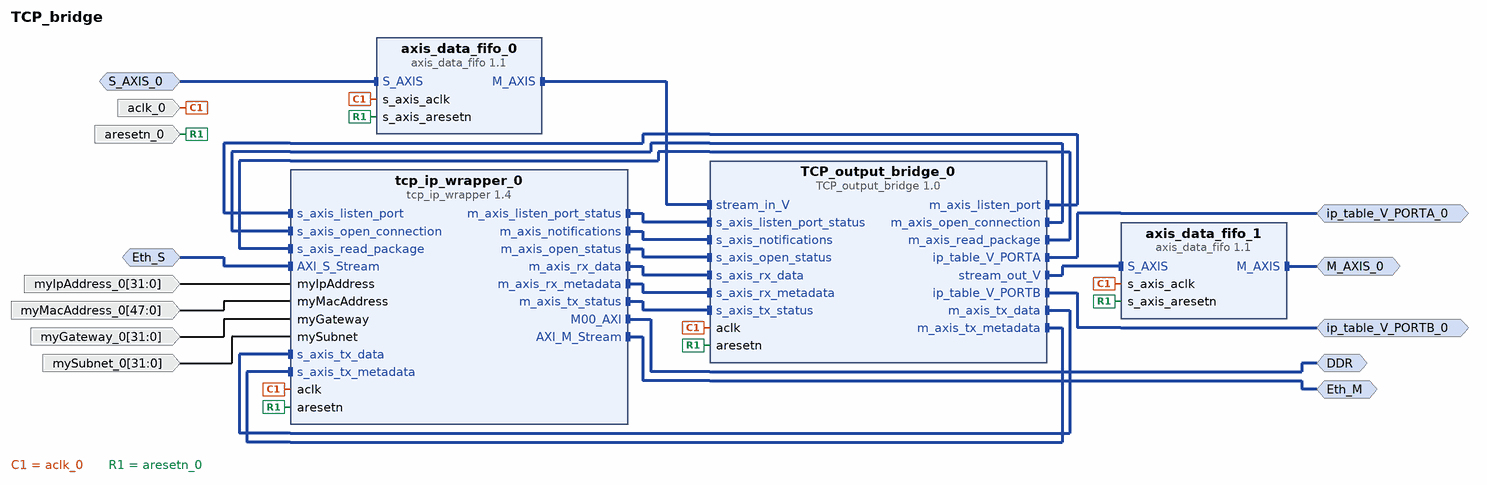
[diagram p0: block diagram of the top level]
# Vivado block design TCP_bridge, xcku115-flva1517-2-e, Vivado 2018.1
create_bd_design TCP_bridge

create_bd_intf_port -mode Slave -vlnv xilinx.com:interface:axis_rtl:1.0 Eth_S
set_property -dict [list \
  CONFIG.TDATA_NUM_BYTES 8 \
  CONFIG.TDEST_WIDTH 0 \
  CONFIG.TID_WIDTH 0 \
  CONFIG.TUSER_WIDTH 0 \
  CONFIG.HAS_TREADY 1 \
  CONFIG.HAS_TSTRB 0 \
  CONFIG.HAS_TKEEP 1 \
  CONFIG.HAS_TLAST 1 \
  CONFIG.LAYERED_METADATA undef \
] [get_bd_intf_ports Eth_S]
create_bd_intf_port -mode Slave -vlnv xilinx.com:interface:axis_rtl:1.0 S_AXIS_0
set_property -dict [list \
  CONFIG.TDATA_NUM_BYTES 8 \
  CONFIG.TDEST_WIDTH 16 \
  CONFIG.TID_WIDTH 0 \
  CONFIG.TUSER_WIDTH 0 \
  CONFIG.HAS_TREADY 1 \
  CONFIG.HAS_TSTRB 0 \
  CONFIG.HAS_TKEEP 1 \
  CONFIG.HAS_TLAST 1 \
  CONFIG.LAYERED_METADATA undef \
] [get_bd_intf_ports S_AXIS_0]
create_bd_intf_port -mode Master -vlnv xilinx.com:interface:axis_rtl:1.0 M_AXIS_0
create_bd_intf_port -mode Master -vlnv xilinx.com:interface:aximm_rtl:1.0 DDR
set_property -dict [list \
  CONFIG.DATA_WIDTH 64 \
  CONFIG.PROTOCOL AXI4 \
  CONFIG.ADDR_WIDTH 32 \
  CONFIG.HAS_REGION 0 \
  CONFIG.NUM_READ_OUTSTANDING 2 \
  CONFIG.NUM_WRITE_OUTSTANDING 2 \
] [get_bd_intf_ports DDR]
create_bd_intf_port -mode Master -vlnv xilinx.com:interface:axis_rtl:1.0 Eth_M
create_bd_intf_port -mode Master -vlnv xilinx.com:interface:bram_rtl:1.0 ip_table_V_PORTA_0
set_property -dict {CONFIG.MASTER_TYPE BRAM_CTRL} [get_bd_intf_ports ip_table_V_PORTA_0]
create_bd_intf_port -mode Master -vlnv xilinx.com:interface:bram_rtl:1.0 ip_table_V_PORTB_0
set_property -dict {CONFIG.MASTER_TYPE BRAM_CTRL} [get_bd_intf_ports ip_table_V_PORTB_0]
create_bd_port -dir I -type clk aclk_0
set_property -dict {CONFIG.ASSOCIATED_BUSIF Eth_S:S_AXIS_0:M_AXIS_0:DDR:Eth_M} [get_bd_ports aclk_0]
create_bd_port -dir I -type rst aresetn_0
create_bd_port -dir I -from 31 -to 0 myIpAddress_0
create_bd_port -dir I -from 47 -to 0 myMacAddress_0
create_bd_port -dir I -from 31 -to 0 myGateway_0
create_bd_port -dir I -from 31 -to 0 mySubnet_0

create_bd_cell -type ip -vlnv dlyma.org:dlyma:tcp_ip_wrapper:1.4 tcp_ip_wrapper_0
set_property -dict {CONFIG.UDP_ENABLE false} [get_bd_cells tcp_ip_wrapper_0]
create_bd_cell -type ip -vlnv xilinx.com:ip:axis_data_fifo:1.1 axis_data_fifo_0
create_bd_cell -type ip -vlnv xilinx.com:ip:axis_data_fifo:1.1 axis_data_fifo_1
create_bd_cell -type ip -vlnv xilinx.com:hls:TCP_output_bridge:1.0 TCP_output_bridge_0

# ---- connections ----

connect_bd_intf_net [get_bd_intf_pins tcp_ip_wrapper_0/m_axis_listen_port_status] [get_bd_intf_pins TCP_output_bridge_0/s_axis_listen_port_status]
connect_bd_intf_net [get_bd_intf_pins tcp_ip_wrapper_0/m_axis_notifications] [get_bd_intf_pins TCP_output_bridge_0/s_axis_notifications]
connect_bd_intf_net [get_bd_intf_pins tcp_ip_wrapper_0/m_axis_open_status] [get_bd_intf_pins TCP_output_bridge_0/s_axis_open_status]
connect_bd_intf_net [get_bd_intf_pins tcp_ip_wrapper_0/m_axis_rx_data] [get_bd_intf_pins TCP_output_bridge_0/s_axis_rx_data]
connect_bd_intf_net [get_bd_intf_pins tcp_ip_wrapper_0/m_axis_rx_metadata] [get_bd_intf_pins TCP_output_bridge_0/s_axis_rx_metadata]
connect_bd_intf_net [get_bd_intf_pins tcp_ip_wrapper_0/m_axis_tx_status] [get_bd_intf_pins TCP_output_bridge_0/s_axis_tx_status]
connect_bd_intf_net [get_bd_intf_pins tcp_ip_wrapper_0/s_axis_listen_port] [get_bd_intf_pins TCP_output_bridge_0/m_axis_listen_port]
connect_bd_intf_net [get_bd_intf_pins tcp_ip_wrapper_0/s_axis_open_connection] [get_bd_intf_pins TCP_output_bridge_0/m_axis_open_connection]
connect_bd_intf_net [get_bd_intf_pins tcp_ip_wrapper_0/s_axis_read_package] [get_bd_intf_pins TCP_output_bridge_0/m_axis_read_package]
connect_bd_intf_net [get_bd_intf_pins tcp_ip_wrapper_0/s_axis_tx_data] [get_bd_intf_pins TCP_output_bridge_0/m_axis_tx_data]
connect_bd_intf_net [get_bd_intf_pins tcp_ip_wrapper_0/s_axis_tx_metadata] [get_bd_intf_pins TCP_output_bridge_0/m_axis_tx_metadata]
connect_bd_intf_net [get_bd_intf_pins axis_data_fifo_0/M_AXIS] [get_bd_intf_pins TCP_output_bridge_0/stream_in_V]
connect_bd_intf_net [get_bd_intf_pins TCP_output_bridge_0/stream_out_V] [get_bd_intf_pins axis_data_fifo_1/S_AXIS]
connect_bd_intf_net -intf_net AXI_S_Stream_0_1 [get_bd_intf_ports Eth_S] [get_bd_intf_pins tcp_ip_wrapper_0/AXI_S_Stream]
connect_bd_intf_net -intf_net S_AXIS_0_1 [get_bd_intf_ports S_AXIS_0] [get_bd_intf_pins axis_data_fifo_0/S_AXIS]
connect_bd_intf_net [get_bd_intf_ports M_AXIS_0] [get_bd_intf_pins axis_data_fifo_1/M_AXIS]
connect_bd_intf_net [get_bd_intf_ports DDR] [get_bd_intf_pins tcp_ip_wrapper_0/M00_AXI]
connect_bd_intf_net [get_bd_intf_ports Eth_M] [get_bd_intf_pins tcp_ip_wrapper_0/AXI_M_Stream]
connect_bd_intf_net [get_bd_intf_ports ip_table_V_PORTA_0] [get_bd_intf_pins TCP_output_bridge_0/ip_table_V_PORTA]
connect_bd_intf_net [get_bd_intf_ports ip_table_V_PORTB_0] [get_bd_intf_pins TCP_output_bridge_0/ip_table_V_PORTB]
connect_bd_net -net aclk_0_1 [get_bd_ports aclk_0] \
  [get_bd_pins tcp_ip_wrapper_0/aclk] [get_bd_pins axis_data_fifo_1/s_axis_aclk] [get_bd_pins axis_data_fifo_0/s_axis_aclk] \
  [get_bd_pins TCP_output_bridge_0/aclk]
connect_bd_net -net aresetn_0_1 [get_bd_ports aresetn_0] \
  [get_bd_pins tcp_ip_wrapper_0/aresetn] [get_bd_pins axis_data_fifo_1/s_axis_aresetn] \
  [get_bd_pins axis_data_fifo_0/s_axis_aresetn] [get_bd_pins TCP_output_bridge_0/aresetn]
connect_bd_net -net myIpAddress_0_1 [get_bd_ports myIpAddress_0] [get_bd_pins tcp_ip_wrapper_0/myIpAddress]
connect_bd_net -net myMacAddress_0_1 [get_bd_ports myMacAddress_0] [get_bd_pins tcp_ip_wrapper_0/myMacAddress]
connect_bd_net -net myGateway_0_1 [get_bd_ports myGateway_0] [get_bd_pins tcp_ip_wrapper_0/myGateway]
connect_bd_net -net mySubnet_0_1 [get_bd_ports mySubnet_0] [get_bd_pins tcp_ip_wrapper_0/mySubnet]

# ---- address map ----
assign_bd_address -offset 0x00000000 -range 4G -target_address_space [get_bd_addr_spaces tcp_ip_wrapper_0/M00_AXI] [get_bd_addr_segs DDR/Reg]

validate_bd_design
save_bd_design
